# EAGLE design dc-filter-v1.0 (EAGLE 8.7.1)
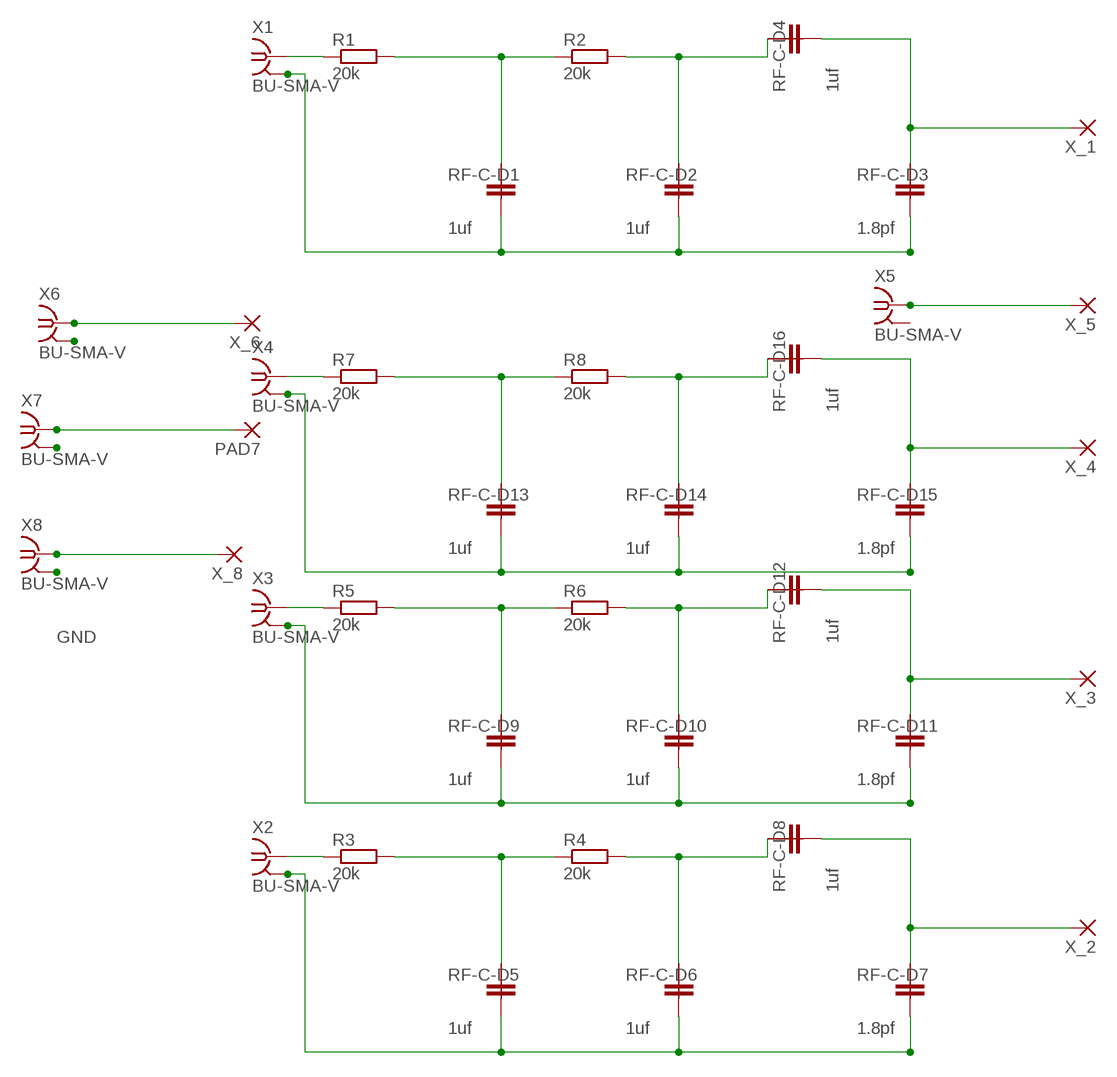
[diagram p0: schematic, sheet 1]

## Parts
PAD7  SMD5  [SMD2,54-5,08]
R1  20k  R-EU_R0402  [R0402]
R2  20k  R-EU_R0402  [R0402]
R3  20k  R-EU_R0402  [R0402]
R4  20k  R-EU_R0402  [R0402]
R5  20k  R-EU_R0402  [R0402]
R6  20k  R-EU_R0402  [R0402]
R7  20k  R-EU_R0402  [R0402]
R8  20k  R-EU_R0402  [R0402]
RF-C-D1  1uf  RF-CAPACITORSCBR06C509BAGAC  [0603]
RF-C-D2  1uf  RF-CAPACITORSCBR06C509BAGAC  [0603]
RF-C-D3  1.8pf  RF-CAPACITORSCBR06C509BAGAC  [0603]
RF-C-D4  1uf  RF-CAPACITORSCBR06C509BAGAC  [0603]
RF-C-D5  1uf  RF-CAPACITORSCBR06C509BAGAC  [0603]
RF-C-D6  1uf  RF-CAPACITORSCBR06C509BAGAC  [0603]
RF-C-D7  1.8pf  RF-CAPACITORSCBR06C509BAGAC  [0603]
RF-C-D8  1uf  RF-CAPACITORSCBR06C509BAGAC  [0603]
RF-C-D9  1uf  RF-CAPACITORSCBR06C509BAGAC  [0603]
RF-C-D10  1uf  RF-CAPACITORSCBR06C509BAGAC  [0603]
RF-C-D11  1.8pf  RF-CAPACITORSCBR06C509BAGAC  [0603]
RF-C-D12  1uf  RF-CAPACITORSCBR06C509BAGAC  [0603]
RF-C-D13  1uf  RF-CAPACITORSCBR06C509BAGAC  [0603]
RF-C-D14  1uf  RF-CAPACITORSCBR06C509BAGAC  [0603]
RF-C-D15  1.8pf  RF-CAPACITORSCBR06C509BAGAC  [0603]
RF-C-D16  1uf  RF-CAPACITORSCBR06C509BAGAC  [0603]
X1  BU-SMA-V  [BU-SMA-V]
X2  BU-SMA-V  [BU-SMA-V]
X3  BU-SMA-V  [BU-SMA-V]
X4  BU-SMA-V  [BU-SMA-V]
X5  BU-SMA-V  [BU-SMA-V]
X6  BU-SMA-V  [BU-SMA-V]
X7  BU-SMA-V  [BU-SMA-V]
X8  BU-SMA-V  [BU-SMA-V]
X_1  SMD5  [SMD2,54-5,08]
X_2  SMD5  [SMD2,54-5,08]
X_3  SMD5  [SMD2,54-5,08]
X_4  SMD5  [SMD2,54-5,08]
X_5  SMD5  [SMD2,54-5,08]
X_6  SMD5  [SMD2,54-5,08]
X_8  SMD5  [SMD2,54-5,08]

## Nets
GND: RF-C-D1.P$2 RF-C-D2.P$2 RF-C-D3.P$2 RF-C-D5.P$2 RF-C-D6.P$2 RF-C-D7.P$2 RF-C-D9.P$2 RF-C-D10.P$2 RF-C-D11.P$2 RF-C-D13.P$2 RF-C-D14.P$2 RF-C-D15.P$2 X1.2 X1.3 X1.4 X1.5 X2.2 X2.3 X2.4 X2.5 X3.2 X3.3 X3.4 X3.5 X4.2 X4.3 X4.4 X4.5 X6.2 X6.3 X6.4 X6.5 X7.2 X7.3 X7.4 X7.5 X8.2 X8.3 X8.4 X8.5
N$1: R1.2 R2.1 RF-C-D1.P$1
N$2: R2.2 RF-C-D2.P$1 RF-C-D4.P$1
N$3: R3.2 R4.1 RF-C-D5.P$1
N$4: R1.1 X1.1
N$5: RF-C-D3.P$1 RF-C-D4.P$2 X_1.1(P)
N$6: R4.2 RF-C-D6.P$1 RF-C-D8.P$1
N$7: R3.1 X2.1
N$8: RF-C-D7.P$1 RF-C-D8.P$2 X_2.1(P)
N$9: R5.2 R6.1 RF-C-D9.P$1
N$10: R6.2 RF-C-D10.P$1 RF-C-D12.P$1
N$11: R5.1 X3.1
N$12: RF-C-D11.P$1 RF-C-D12.P$2 X_3.1(P)
N$13: R7.2 R8.1 RF-C-D13.P$1
N$14: R8.2 RF-C-D14.P$1 RF-C-D16.P$1
N$15: R7.1 X4.1
N$16: RF-C-D15.P$1 RF-C-D16.P$2 X_4.1(P)
N$17: X5.1 X_5.1(P)
N$18: X6.1 X_6.1(P)
N$19: PAD7.1(P) X7.1
X_10: X8.1 X_8.1(P)
Unconnected: X5.2 X5.3 X5.4 X5.5

## Library data of the parts
PAD7 X_1-X_6 X_8 = wirepad:SMD5: SMD PAD
R1-R8 = resistor:R-EU_: RESISTOR, European symbol
RF-C-D1-RF-C-D16 = Compact RF Amplifier:RF-CAPACITORS: 1210：型号：MC12CF050D-F 电容大小：5pf 1000v// 0603：型号：CBR06C509BAGAC 电容大小：5pf 250v// 2220：型号：MC22FD102J-F 电容大小：1000pf 500v// 1111：型号：VJ1111D102KXDAJ电容大小：1000pf 300v//
X1-X8 = con-coax:BU-SMA-V: FEMALE SMA CONNECTOR Radiall distributor RS 112-3794; OC_FARNELL: unknown; OC_NEWARK: unknown

## Board
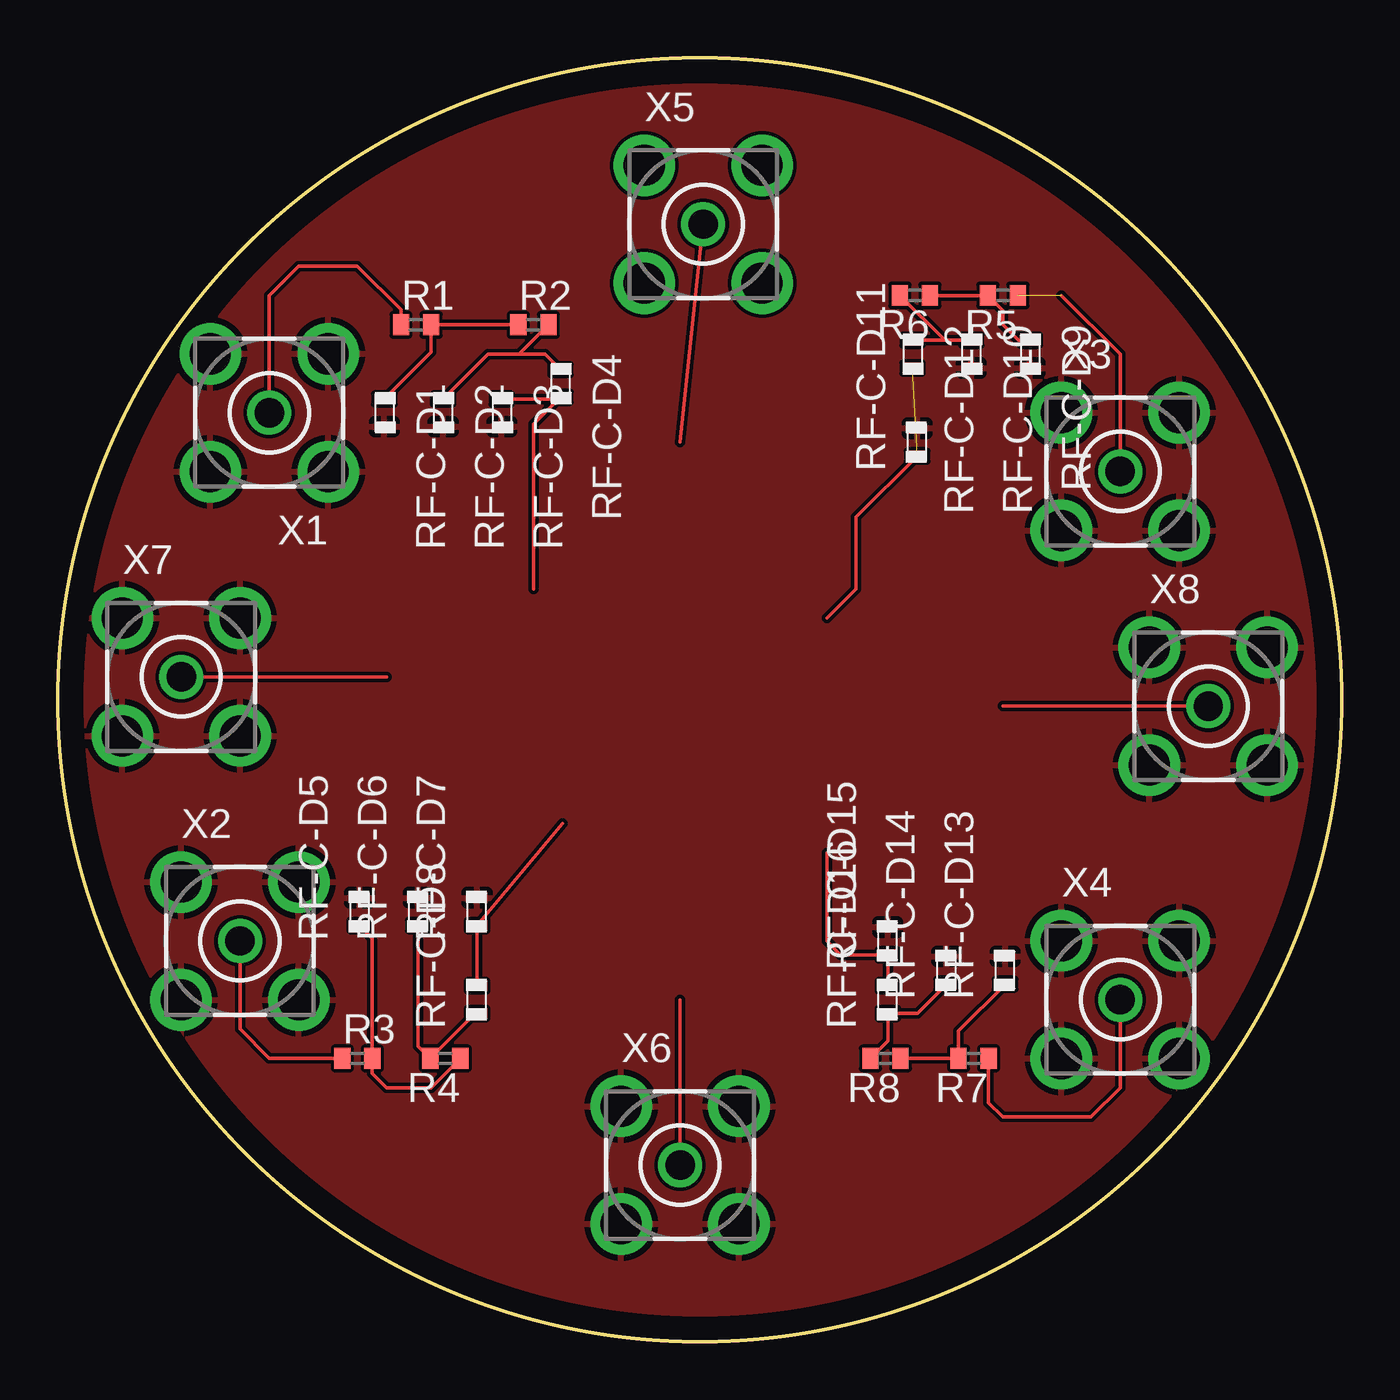
[diagram p1: board, top side]
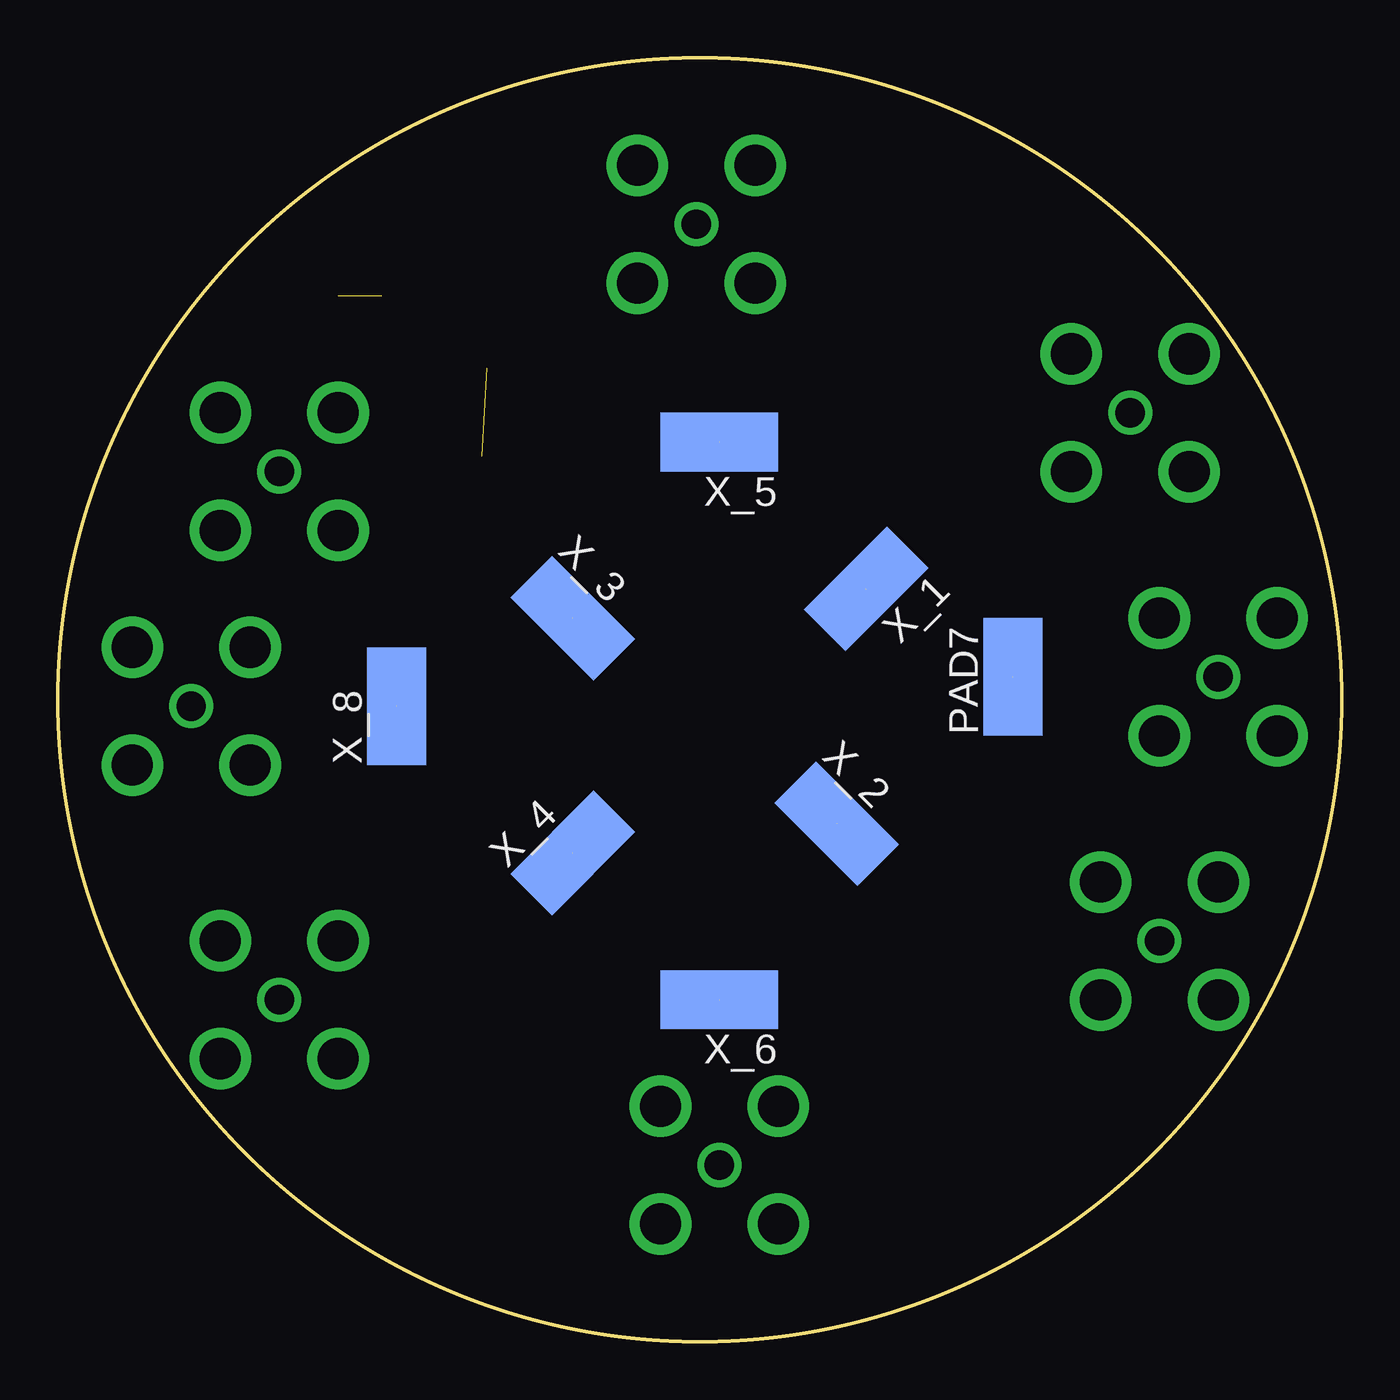
[diagram p2: board, bottom side, seen from below]

Size 55.57 x 55.57 mm. Coordinates in mm from the lower left corner, seen from the top.
Outline: circle at 27.78,27.78 radius 27.78
Copper layers (1*16): Top 0.035mm / dielectric 1.5mm / Bottom 0.035mm
Design rules "default": minimum track width 6mil, minimum drill 0.35mm, track to track 6mil, track to pad 6mil, pad to pad 6mil, via to via 6mil, smd to smd 6mil, copper to edge 40mil, drill to drill 6mil, minimum pad ring 10mil, minimum via ring 8mil, stop-mask expansion 4mil, vias tented up to drill 0mil, thermal gap 10mil

### Footprints (pad centres in the part's own frame; a part is rotated, then mirrored left to right if it is on the bottom)
SMD2,54-5,08 = smd 2.54 x 5.08: 1 0,0
R0402 = smd 0.7 x 0.9: 1 -0.65,0; 2 0.65,0
0603 = smd 0.45 x 0.85: P$1 -0.6,-0.1; P$2 0.6,-0.1
BU-SMA-V = drill 1.27: 1 0,0 | drill 1.778: 2 -2.55,2.55; 3 2.55,2.55; 4 2.55,-2.55; 5 -2.55,-2.55

### Placement (x,y rotation side)
PAD7  14.23,28.77 0 bottom
R1  15.5,44.01 0 top
R2  20.58,44.01 0 top
R3  12.96,12.26 0 top
R4  16.77,12.26 180 top
R5  40.9,45.28 180 top
R6  37.09,45.28 180 top
R7  39.63,12.26 180 top
R8  35.82,12.26 180 top
RF-C-D1  14.23,40.2 270 top
RF-C-D2  16.77,40.2 270 top
RF-C-D3  19.31,40.2 270 top
RF-C-D4  21.85,41.47 270 top
RF-C-D5  12.96,18.61 90 top
RF-C-D6  15.5,18.61 90 top
RF-C-D7  18.04,18.61 90 top
RF-C-D8  18.04,14.8 90 top
RF-C-D9  42.17,42.74 270 top
RF-C-D10  39.63,42.74 270 top
RF-C-D11  37.09,38.93 90 top
RF-C-D12  37.09,42.74 270 top
RF-C-D13  40.9,16.07 90 top
RF-C-D14  38.36,16.07 90 top
RF-C-D15  35.82,17.34 90 top
RF-C-D16  35.82,14.8 90 top
X1  9.15,40.2 180 top
X2  7.88,17.34 0 top
X3  45.98,37.66 0 top
X4  45.98,14.8 0 top
X5  27.93,48.36 0 top
X6  26.93,7.64 0 top
X7  5.34,28.77 0 top
X8  49.79,27.5 0 top
X_1  20.58,32.58 135 bottom
X_2  21.85,22.42 225 bottom
X_3  33.28,31.31 225 bottom
X_4  33.28,21.15 315 bottom
X_5  26.93,38.93 90 bottom
X_6  26.93,14.8 90 bottom
X_8  40.9,27.5 0 bottom

### Tracks (layer width: path | path; a pad name or v marks a point on that pad's centre or on a via)
GND
  pour Top: -0.22,27.78 arc-90 27.78,55.78 arc-94 55.78,25.78 arc-84 28.78,-0.22 arc-92
N$1
  Top 0.152: R2.1 R1.2 16.15,42.82 RF-C-D1.P$1
N$2
  Top 0.152: RF-C-D2.P$1 18.61,42.74 19.96,42.74 | 19.96,42.74 R2.2 | 19.96,42.74 21.08,42.74 RF-C-D4.P$1
N$3
  Top 0.152: RF-C-D5.P$1 13.61,17.46 R3.2 13.61,11.61 14.23,10.99 16.15,10.99 R4.1
N$4
  Top 0.152: X1.1 9.15,45.28 10.42,46.55 12.96,46.55 14.85,44.66 R1.1
N$5  (1 unrouted)
  Top 0.152: RF-C-D3.P$1 21.68,40.8 RF-C-D4.P$2 20.58,39.7 X_1.1
N$6
  Top 0.152: RF-C-D8.P$1 18.06,14.2 R4.2 15.6,12.78 RF-C-D6.P$1
N$7
  Top 0.152: X2.1 7.88,13.53 9.15,12.26 R3.1
N$8  (1 unrouted)
  Top 0.152: RF-C-D8.P$2 RF-C-D7.P$1 X_2.1
N$9
  Top 0.152: R6.1 R5.2 40.9,44.63 40.9,44.01 41.57,43.34 RF-C-D9.P$1
N$10
  Top 0.152: R6.2 38.38,43.34 RF-C-D10.P$1 RF-C-D12.P$1
N$11  (1 unrouted)
  Top 0.152: X3.1 45.98,42.74 43.44,45.28
N$12  (2 unrouted)
  Top 0.152: RF-C-D11.P$1 34.55,35.69 34.55,32.58 X_3.1
N$13
  Top 0.152: R8.1 R7.2 38.98,13.45 RF-C-D13.P$1
N$14
  Top 0.152: R8.2 35.92,13.01 RF-C-D16.P$1 37.19,14.2 RF-C-D14.P$1
N$15
  Top 0.152: X4.1 45.98,10.99 44.71,9.72 40.9,9.72 40.28,10.34 R7.1
N$16  (1 unrouted)
  Top 0.152: RF-C-D16.P$2 RF-C-D15.P$1 33.88,16.74 33.28,17.34 X_4.1
N$17  (1 unrouted)
  Top 0.152: X5.1 X_5.1
N$18  (1 unrouted)
  Top 0.152: X6.1 X_6.1
N$19  (1 unrouted)
  Top 0.152: X7.1 PAD7.1
X_10  (1 unrouted)
  Top 0.152: X8.1 X_8.1